# Altium project Radio Team RF board.PrjPcb
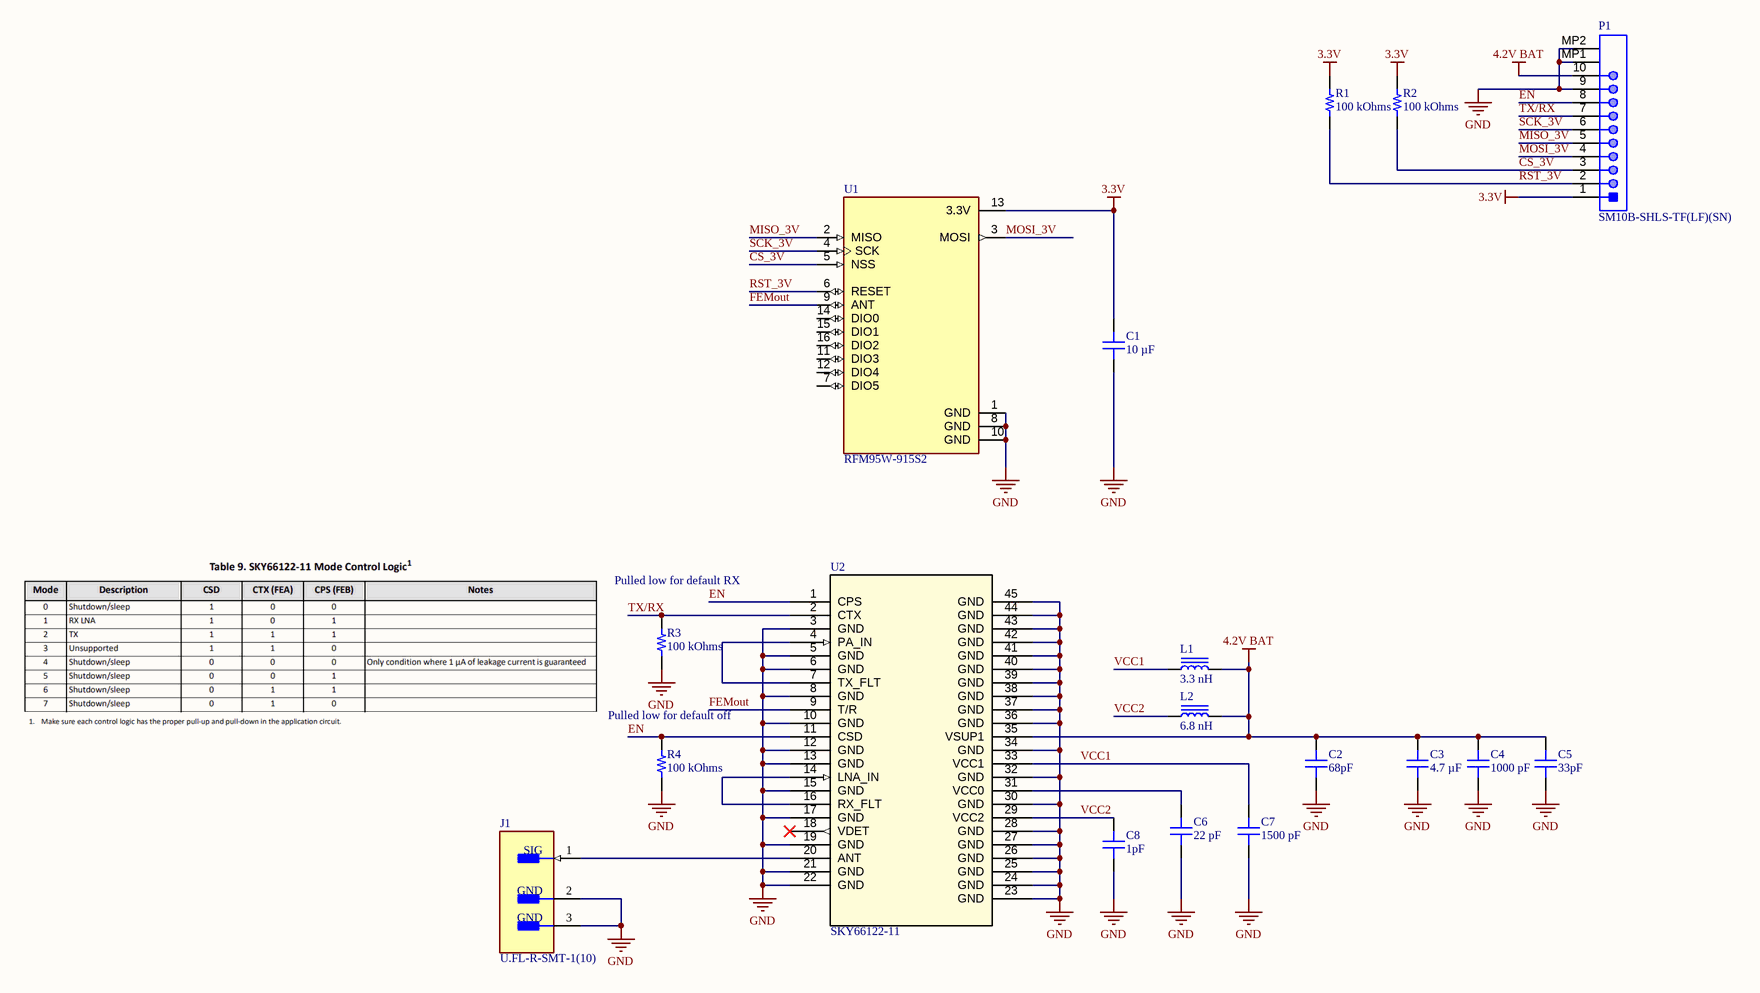
[diagram p0: Radio.SchDoc]
CAGE_CODE: ?????; CONTRACT_NUMBER: <CONTRACT NO>; DOC_NO_ASSY_DWG: <ASSY DWG NO>; DOC_NO_BOM: <BOM DOC NO>; DOC_NO_FAB_DWG: <FAB DWG NO>; DOC_NO_SCH_DWG: <SCH DWG NO>; PCB_2_DEC_TOL: +/-.01; PCB_3_DEC_TOL: +/-.010; PCB_ANG_TOL: +/-1/2; PCB_ASSEMBLY_NO: <PCB ASSY NO>; PCB_CHECKER: - -----; PCB_CHECKER_APP_DATE: --/--/----; PCB_DESIGNER: - -----; PCB_DESIGNER_APP_DATE: --/--/----; PCB_DWG_NO: <PCB DWG NO>; PCB_ENGINEER: - -----; PCB_ENGINEER_APP_DATE: --/--/----; PCB_PART_NUMBER: <PCB PN>; PCB_REV: A; SCH_REV: A
1 sheet, 18 parts. Net scope: global (net labels, ports and power ports of the same name join across sheets).
Board file: Radio.PcbDoc

## Sheet Radio.SchDoc
size 431 x 279 mm; SheetNumber: 1; SheetTotal: 1; ENG_APP_DATE: --/--/--; DSN_APP_DATE: --/--/--; CHK_APP_DATE: --/--/--

### Parts
C1  10 µF  [CAP 0805_2012]
C2  68pF  [CAP 0805_2012]
C3  4.7 µF  [CAP 0805_2012]
C4  1000 pF  [CAP 0805_2012]
C5  33pF  [CAP 0805_2012]
C6  22 pF  [CAP 0805_2012]
C7  1500 pF  [CAP 0805_2012]
C8  1pF  [CAP 0805_2012]
J1  U.FL-R-SMT-1(10)  [FP-U_FL-R-SMT-1_10-MFG]
L1  3.3 nH  [IND 0402_1005]
L2  6.8 nH  [IND 0402_1005]
P1  SM10B-SHLS-TF(LF)(SN)  [JST-SM10B-SHLS-TF_V]
R1  100 kOhms  [RES 0805_2012]
R2  100 kOhms  [RES 0805_2012]
R3  100 kOhms  [RES 0805_2012]
R4  100 kOhms  [RES 0805_2012]
U1  RFM95W-915S2  [XCVR_RFM95W-915S2]
U2  SKY66122-11  [SKY66122-11_SKY]

### Nets
3.3V: C1.2 P1.1 R1.2 R2.2 U1.13(3.3V)
4.2V BAT: C2.2 C3.2 C4.2 C5.2 L1.2 L2.2 P1.10 U2.35(VSUP1)
GND: C1.1 C2.1 C3.1 C4.1 C5.1 C6.1 C7.1 C8.1 J1.2(GND) J1.3(GND) P1.9 P1.MP1 P1.MP2 R3.1 R4.1 U1.1(GND) U1.8(GND) U1.10(GND) U2.3(GND) U2.5(GND) U2.6(GND) U2.8(GND) U2.10(GND) U2.12(GND) U2.13(GND) U2.15(GND) U2.17(GND) U2.19(GND) U2.21(GND) U2.22(GND) U2.23(GND) U2.24(GND) U2.25(GND) U2.26(GND) U2.27(GND) U2.28(GND) U2.30(GND) U2.32(GND) U2.34(GND) U2.36(GND) U2.37(GND) U2.38(GND) U2.39(GND) U2.40(GND) U2.41(GND) U2.42(GND) U2.43(GND) U2.44(GND) U2.45(GND)
CS_3V: P1.3 R2.1 U1.5(NSS)
EN: P1.8 R4.2 U2.1(CPS) U2.11(CSD)
FEMout: U1.9(ANT) U2.9(T/R)
MISO_3V: P1.5 U1.2(MISO)
MOSI_3V: P1.4 U1.3(MOSI)
RST_3V: P1.2 R1.1 U1.6(RESET)
SCK_3V: P1.6 U1.4(SCK)
TX/RX: P1.7 R3.2 U2.2(CTX)
VCC1: C7.2 L1.1 U2.33(VCC1)
VCC2: C8.2 L2.1 U2.29(VCC2)
NetC6_2: C6.2 U2.31(VCC0)
NetJ1_1: J1.1(SIG) U2.20(ANT)
NetU2_4: U2.4(PA_IN) U2.7(TX_FLT)
NetU2_14: U2.14(LNA_IN) U2.16(RX_FLT)

Not connected (* = marked no-connect by the designer): U1 7(DIO5) 11(DIO3) 12(DIO4) 14(DIO0) 15(DIO1) 16(DIO2); U2 18(VDET)*

### Notes on the sheet
- (near R3) Pulled low for default RX
- (near R4) Pulled low for default off
- DWG. NO.
- REV.
- SHT.
- THIS DOCUMENT AND THE DATA DISCLOSED HEREIN OR HEREWITH IS THE PROPERTY OF ALTIUM LIMITED AND MAY BE FREELY DISTRIBUTED IN WHOLE. NO RIGHTS ARE RESERVED OR EXPRESS OR IMPLIED WARANTEE GIVEN.
- REVISION
- DESCRIPTION
- DATE
- APPROVED
- ENG:
- APPROVALS
- PROJECT
- DSN:
- CHK:
- REFERENCE DOCUMENTS
- PROJECT REVISION:
- TITLE
- DOCUMENT REVISION:
- DESIGN ITEM:
- BOM:
- FAB DWG:
- PCB DWG:
- ASSY DWG:
- SCALE:
- SIZE
- B
- CAGE CODE
- FILE NAME
- DWG NO.
- SHEET
- OF
- REV

### Library data of the parts
C1 = MD0805BB106M100NHT-EM: CAP CER 10UF 10V X7R 0805; manufacturer: Knowles Novacap; Tolerance: ±20%; Part Number: MD0805BB106M100NHT-EM; Capacitance: 10 µF; Applications: Medical, Non-Critical; componentlink1description: Datasheet; componentlink1url: https://mm.digikey.com/Volume0/opasdata/d220001/medias/docus/5546/MD Series R3.pdf; componentlink2description: DigiKey Link; componentlink2url: https://www.digikey.com/en/products/detail/knowles-novacap/MD0805BB106M100NHT-EM/21406856; Device Package: 0805 (2012 Metric); lastupdated: 2/9/2024 8:13:14 PM; Lifecycle Status: Active; Minimum Order: 1; Mounting Type: Surface Mount, MLCC; Operating Temperature: -55°C ~ 125°C; Package / Case: 0805 (2012 Metric); packaging: TapeAndReel; partid: 57210; price: 0.59; series: MD; Supplier 1: DigiKey; Supplier Part Number 1: 1763-MD0805BB106M100NHT-EMCT-ND; Temperature Coefficient: X7R; value: 10 µF; Voltage - Rated: 10V
C2 = 08055A680JAT2A: CAP CER 68PF 50V C0G/NP0 0805; manufacturer: AVX Corporation; Temperature Coefficient: C0G, NP0; Tolerance: ±5%; Part Number: 08055A680JAT2A; Capacitance: 68pF; Applications: General Purpose; componentlink1description: Datasheet; componentlink1url: http://datasheets.avx.com/C0GNP0-Dielectric.pdf; componentlink2description: DigiKey Link; componentlink2url: http://digikey.com/product-detail/en/avx-corporation/08055A680JAT2A/478-1314-1-ND/564346; Device Package: 0805 (2012 Metric); lastupdated: 9/2/2020 1:04:40 AM; Lifecycle Status: Active; Minimum Order: 1; Mounting Type: Surface Mount, MLCC; Operating Temperature: -55°C ~ 125°C; Package / Case: 0805 (2012 Metric); packaging: TapeAndReel; partid: 3231; Part Status: Active; price: 0.02; series: -; Size / Dimension: 0.079" L x 0.049" W (2.01mm x 1.25mm); Supplier 1: DigiKey; Supplier Part Number 1: 478-1314-1-ND; Thickness (Max): 0.037" (0.94mm); value: 68pF; Voltage - Rated: 50V
C3 = CL21B475KAFNNNE: CAP CER 4.7UF 25V X7R 0805; manufacturer: Samsung Electro-Mechanics; Tolerance: ±10%; Part Number: CL21B475KAFNNNE; Capacitance: 4.7 µF; Applications: General Purpose; componentlink1description: Datasheet; componentlink1url: http://www.samsungsem.com/kr/support/product-search/mlcc/CL21B475KAFNNNE.jsp; componentlink2description: DigiKey Link; componentlink2url: https://www.digikey.com/en/products/detail/samsung-electro-mechanics/CL21B475KAFNNNE/3888627; Device Package: 0805 (2012 Metric); lastupdated: 2/9/2024 8:16:07 PM; Lifecycle Status: Active; Minimum Order: 1; Mounting Type: Surface Mount, MLCC; Operating Temperature: -55°C ~ 125°C; Package / Case: 0805 (2012 Metric); packaging: TapeAndReel; partid: 3072; Part Status: Active; price: 0.08; series: CL; Size / Dimension: 0.079" L x 0.049" W (2.00mm x 1.25mm); Supplier 1: DigiKey; Supplier Part Number 1: 1276-2969-1-ND; Temperature Coefficient: X7R; Thickness (Max): 0.053" (1.35mm); value: 4.7 µF; Voltage - Rated: 25V
C4 = C0805X102J5HACAUTO: CAP CER 0805 1NF 50V ULTRA STABL; manufacturer: KEMET; Temperature Coefficient: X8R; Tolerance: ±5%; Part Number: C0805X102J5HACAUTO; Capacitance: 1000 pF; Applications: Automotive, Boardflex Sensitive; componentlink1description: Datasheet; componentlink1url: https://api.kemet.com/component-edge/download/datasheet/C0805X102J5HACAUTO.pdf; componentlink2description: DigiKey Link; componentlink2url: https://www.digikey.com/en/products/detail/kemet/C0805X102J5HACAUTO/8324462; Device Package: 0805 (2012 Metric); Features: Low ESL, Soft Termination, High Temperature; lastupdated: 2/9/2024 8:16:01 PM; Lifecycle Status: Active; Minimum Order: 1; Mounting Type: Surface Mount, MLCC; Operating Temperature: -55°C ~ 150°C; Package / Case: 0805 (2012 Metric); packaging: TapeAndReel; partid: 5533; Part Status: Active; price: 0.02; Ratings: AEC-Q200; series: SMD Auto X8R HT150C Flex; Size / Dimension: 0.079" L x 0.049" W (2.00mm x 1.25mm); Supplier 1: DigiKey; Supplier Part Number 1: 399-16876-1-ND; Thickness (Max): 0.039" (0.98mm); value: 1000 pF; Voltage - Rated: 50V
C5 = 08055C330KAT2A: CAP CER 33PF 50V X7R 0805; manufacturer: AVX Corporation; Tolerance: ±10%; Part Number: 08055C330KAT2A; Capacitance: 33pF; Applications: General Purpose; componentlink1description: Datasheet; componentlink1url: http://datasheets.avx.com/X7RDielectric.pdf; componentlink2description: DigiKey Link; componentlink2url: http://digikey.com/product-detail/en/avx-corporation/08055C330KAT2A/478-12787-1-ND/9949327; Device Package: 0805 (2012 Metric); lastupdated: 9/2/2020 1:04:40 AM; Lifecycle Status: Active; Minimum Order: 1; Mounting Type: Surface Mount, MLCC; Operating Temperature: -55°C ~ 125°C; Package / Case: 0805 (2012 Metric); packaging: TapeAndReel; partid: 3690; Part Status: Active; price: 0.04; series: -; Size / Dimension: 0.079" L x 0.049" W (2.01mm x 1.25mm); Supplier 1: DigiKey; Supplier Part Number 1: 478-12787-1-ND; Temperature Coefficient: X7R; Thickness (Max): 0.037" (0.94mm); value: 33pF; Voltage - Rated: 50V
C6 = C0805C220J5GACAUTO: CAP CER 22PF 50V C0G/NP0 0805; manufacturer: KEMET; Temperature Coefficient: C0G, NP0; Tolerance: ±5%; Part Number: C0805C220J5GACAUTO; Capacitance: 22 pF; Applications: Automotive; componentlink1description: Datasheet; componentlink1url: https://api.kemet.com/component-edge/download/datasheet/C0805C220J5GACAUTO.pdf; componentlink2description: DigiKey Link; componentlink2url: https://www.digikey.com/en/products/detail/kemet/C0805C220J5GACAUTO/3314930; Device Package: 0805 (2012 Metric); Features: Low ESL; lastupdated: 2/9/2024 8:16:09 PM; Lifecycle Status: Active; Minimum Order: 1; Mounting Type: Surface Mount, MLCC; Operating Temperature: -55°C ~ 125°C; Package / Case: 0805 (2012 Metric); packaging: TapeAndReel; partid: 2537; Part Status: Active; price: 0.01; Ratings: AEC-Q200; series: SMD Auto C0G; Size / Dimension: 0.079" L x 0.049" W (2.00mm x 1.25mm); Supplier 1: DigiKey; Supplier Part Number 1: 399-6937-1-ND; Thickness (Max): 0.035" (0.88mm); value: 22 pF; Voltage - Rated: 50V
C7 = C0805C152KARAC7800: CAP CER 1500PF 250V X7R 0805; manufacturer: KEMET; Tolerance: ±10%; Part Number: C0805C152KARAC7800; Capacitance: 1500 pF; Applications: Bypass, Decoupling; componentlink1description: Datasheet; componentlink1url: https://api.kemet.com/component-edge/download/datasheet/C0805C152KARAC7800.pdf; componentlink2description: DigiKey Link; componentlink2url: https://www.digikey.com/en/products/detail/kemet/C0805C152KARAC7800/2211967; Device Package: 0805 (2012 Metric); lastupdated: 2/9/2024 8:16:01 PM; Lifecycle Status: Active; Minimum Order: 1; Mounting Type: Surface Mount, MLCC; Operating Temperature: -55°C ~ 125°C; Package / Case: 0805 (2012 Metric); packaging: TapeAndReel; partid: 5598; Part Status: Active; price: 0.09; series: SMD Comm X7R; Size / Dimension: 0.079" L x 0.049" W (2.00mm x 1.25mm); Supplier 1: DigiKey; Supplier Part Number 1: 399-15450-1-ND; Temperature Coefficient: X7R; Thickness (Max): 0.035" (0.88mm); value: 1500 pF; Voltage - Rated: 250V
C8 = 08055A1R0CAT2A: CAP CER 1PF 50V C0G/NP0 0805; manufacturer: AVX Corporation; Temperature Coefficient: C0G, NP0; Tolerance: ±0.25pF; Part Number: 08055A1R0CAT2A; Capacitance: 1pF; Applications: General Purpose; componentlink1description: Datasheet; componentlink1url: http://datasheets.avx.com/C0GNP0-Dielectric.pdf; componentlink2description: DigiKey Link; componentlink2url: http://digikey.com/product-detail/en/avx-corporation/08055A1R0CAT2A/478-1292-1-ND/564324; Device Package: 0805 (2012 Metric); lastupdated: 9/2/2020 1:04:39 AM; Lifecycle Status: Active; Minimum Order: 1; Mounting Type: Surface Mount, MLCC; Operating Temperature: -55°C ~ 125°C; Package / Case: 0805 (2012 Metric); packaging: TapeAndReel; partid: 3785; Part Status: Active; price: 0.04; series: -; Size / Dimension: 0.079" L x 0.049" W (2.01mm x 1.25mm); Supplier 1: DigiKey; Supplier Part Number 1: 478-1292-1-ND; Thickness (Max): 0.037" (0.94mm); value: 1pF; Voltage - Rated: 50V
J1 = CMP-2000-05152-3: CONN U.FL RCPT STR 50 OHM SMD; Max Frequency: 6GHz; Connector Type: Coaxial; Body Plating: Silver; Body Material: Bronze; Impedance: 50R; Dielectric Material: Polymer; Insulation Resistance: 500MR; Gender: Male; Packaging: Cut Tape; Length: 3mm; Package Quantity: 2500; Termination: Solder; Lead Free: Lead Free; Series: U.FL; Min Operating Temperature: -40°C; Fastening Type: Snap; Contact Material: Brass; Orientation: Straight; Wire/Cable Type: Coaxial; Frequency: 6GHz; Contact Plating: Gold; Depth: 3.1mm; Weight: 0.001764oz; Max Operating Temperature: 90°C; Radiation Hardening: No; REACH SVHC: No SVHC; Mount: Surface Mount; Housing Color: Beige
L1 = AISC-0402HP-3N3J-T: FIXED IND 3.3NH 1.7A 45 MOHM SMD; Manufacturer: Abracon LLC; DC Resistance (DCR): 45mOhm Max; Frequency - Self Resonant: 8.5GHz; Inductance Frequency - Test: 250 MHz; Material - Core: Ceramic; Q @ Freq: 23 @ 250MHz; Shielding: Unshielded; Tolerance: ±5%; Type: Drum Core, Wirewound; Part Number: AISC-0402HP-3N3J-T; ComponentLink1Description: Datasheet; ComponentLink1URL: https://abracon.com/Magnetics/inductors/AISC-0402HP.pdf; ComponentLink2Description: DigiKey Link; ComponentLink2URL: https://www.digikey.com/en/products/detail/abracon-llc/AISC-0402HP-3N3J-T/4215111; Current Rating (Amps): 1.7 A; Device Package: 0402 (1005 Metric); Height - Seated (Max): 0.024" (0.60mm); Inductance: 3.3 nH; LastUpdated: 6/3/2024 8:12:58 PM; Lifecycle Status: Active; Minimum Order: 1; Mounting Type: Surface Mount; Operating Temperature: -40°C ~ 125°C; Package / Case: 0402 (1005 Metric); Packaging: TapeAndReel; PartId: 2529; Part Status: Active; Price: 0.09; Series: AISC-0402HP; Size / Dimension: 0.039" L x 0.022" W (1.00mm x 0.55mm); Supplier 1: DigiKey; Supplier Part Number 1: 535-AISC-0402HP-3N3J-TCT-ND; Supplier Device Package: 0402 (1005 Metric); Value: 3.3 nH
L2 = AISC-0402HP-6N8J-T: FIXED IND 6.8NH 1.4A 65 MOHM SMD; Manufacturer: Abracon LLC; DC Resistance (DCR): 65mOhm Max; Frequency - Self Resonant: 5.8GHz; Inductance Frequency - Test: 250 MHz; Material - Core: Ceramic; Q @ Freq: 25 @ 250MHz; Shielding: Unshielded; Tolerance: ±5%; Type: Drum Core, Wirewound; Part Number: AISC-0402HP-6N8J-T; ComponentLink1Description: Datasheet; ComponentLink1URL: https://abracon.com/Magnetics/inductors/AISC-0402HP.pdf; ComponentLink2Description: DigiKey Link; ComponentLink2URL: https://www.digikey.com/en/products/detail/abracon-llc/AISC-0402HP-6N8J-T/4215114; Current Rating (Amps): 1.4 A; Device Package: 0402 (1005 Metric); Height - Seated (Max): 0.024" (0.60mm); Inductance: 6.8 nH; LastUpdated: 6/3/2024 8:12:58 PM; Lifecycle Status: Active; Minimum Order: 1; Mounting Type: Surface Mount; Operating Temperature: -40°C ~ 125°C; Package / Case: 0402 (1005 Metric); Packaging: TapeAndReel; PartId: 2530; Part Status: Active; Price: 0.10; Series: AISC-0402HP; Size / Dimension: 0.039" L x 0.022" W (1.00mm x 0.55mm); Supplier 1: DigiKey; Supplier Part Number 1: 535-12227-1-ND; Supplier Device Package: 0402 (1005 Metric); Value: 6.8 nH
P1 = CMP-2000-07083-1: Male Header, Pitch 1 mm, 1 x 10 Position, Height 1.8 mm, -25 to 85 degC; Manufacturer: JST; Datasheet URL: http://www.jst-mfg.com/product/pdf/eng/eSHL.pdf; Mounting Technology: SurfaceMount; Package Reference: SM10B-SHLS-TF; Manufacturer URL: http://www.jst.com/home2.html; Package Description: Male Header, Pitch 1 mm, 1 x 10 Position, Height 1.8 mm; Datasheet Version: 04/2015
R1-R4 = CPF0805B100KE: RES SMD 100K OHM 0.1% 1/10W 0805; Manufacturer: TE Connectivity Passive Product; Power (Watts): 0.1W, 1/10W; Temperature Coefficient: ±25ppm/°C; Part Number: CPF0805B100KE; Value: 100 kOhms; ComponentLink1Description: Datasheet; ComponentLink1URL: https://www.te.com/commerce/DocumentDelivery/DDEController?Action=srchrtrv&DocNm=1773200&DocType=DS&DocLang=English; ComponentLink2Description: DigiKey Link; ComponentLink2URL: https://www.digikey.com/en/products/detail/te-connectivity-passive-product/CPF0805B100KE/2389788; Composition: Thin Film; Device Package: 0805 (2012 Metric); Height - Seated (Max): 0.026" (0.65mm); LastUpdated: 2/8/2024 9:02:39 PM; Lifecycle Status: Active; Minimum Order: 1; Number of Terminations: 2; Operating Temperature: -55°C ~ 155°C; Package / Case: 0805 (2012 Metric); Packaging: TapeAndReel; PartId: 27729; Part Status: Active; Price: 0.09; Resistance: 100 kOhms; Series: CPF, Neohm; Size / Dimension: 0.079" L x 0.049" W (2.00mm x 1.25mm); Supplier 1: DigiKey; Supplier Part Number 1: A106042CT-ND; Supplier Device Package: 0805; Tolerance: ±0.1%
U1 = RFM95W-915S2: RFM95(W) - Low Power Long Range Transceiver Module V1.0; Availability: Unavailable; MP: RFM95W-915S2; Value: *; Package: None; Price: None
U2 = CMP-008-000001-1: No Description Available; Mfr_Name: Skyworks; RefDes: RefDes; Type: Wireless and RF Integrated Circuits; Design Item ID: SKY66122-11; Source: SKY66122-11.SchLib